# EAGLE design ESP-D1-mini-mainboard (EAGLE 9.6.2)
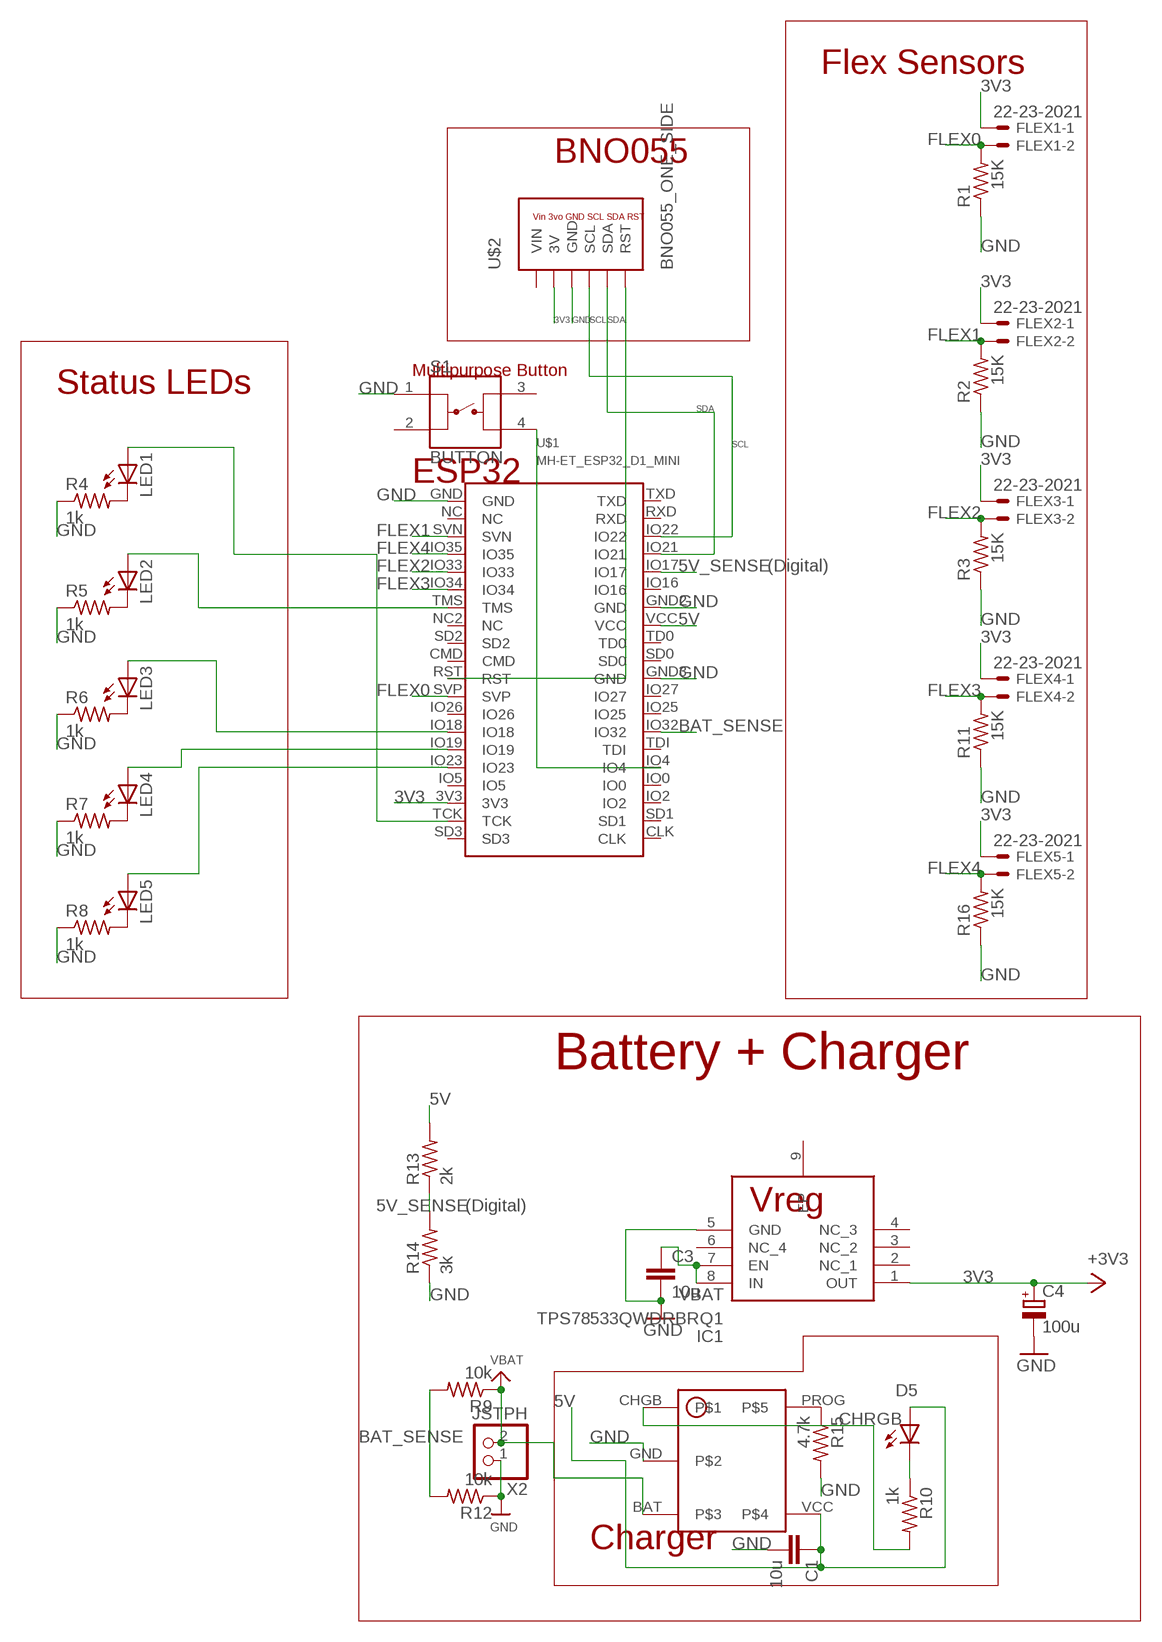
[diagram p0: schematic, sheet 1]

## Parts
C1  10u  C-EUC0805  [C0805]
C3  10u  C-EUC0805  [C0805]
C4  100u  CPOL-EUB/3528-21W  [B/3528-21W]
D5  GREEN  LEDCHIPLED_0805  [CHIPLED_0805]
FLEX1  22-23-2021  [22-23-2021]
FLEX2  22-23-2021  [22-23-2021]
FLEX3  22-23-2021  [22-23-2021]
FLEX4  22-23-2021  [22-23-2021]
FLEX5  22-23-2021  [22-23-2021]
IC1  TPS78533QWDRBRQ1  [SON65P300X300X100-9N]
LED1  LEDCHIPLED_0805  [CHIPLED_0805]
LED2  LEDCHIPLED_0805  [CHIPLED_0805]
LED3  LEDCHIPLED_0805  [CHIPLED_0805]
LED4  LEDCHIPLED_0805  [CHIPLED_0805]
LED5  LEDCHIPLED_0805  [CHIPLED_0805]
R1  15K  R-US_M0805  [M0805]
R2  15K  R-US_M0805  [M0805]
R3  15K  R-US_M0805  [M0805]
R4  1k  R-US_M0805  [M0805]
R5  1k  R-US_M0805  [M0805]
R6  1k  R-US_M0805  [M0805]
R7  1k  R-US_M0805  [M0805]
R8  1k  R-US_M0805  [M0805]
R9  10k  R-US_M0805  [M0805]
R10  1k  R-US_M0805  [M0805]
R11  15K  R-US_M0805  [M0805]
R12  10k  R-US_M0805  [M0805]
R13  2k  R-US_M0805  [M0805]
R14  3k  R-US_M0805  [M0805]
R15  4.7k  R-US_M0805  [M0805]
R16  15K  R-US_M0805  [M0805]
S1  BUTTON  [BUTTON_4_PAD]
U1  DIO5518BAUK+  [SOT23-5L]
U$1  MH-ET_ESP32_D1_MINI  [MH-ET_ESP32_D1_MINI]
U$2  BNO055_ONE_SIDE  [BNO055_ONE_SIDE]
X2  JSTPH  CON_JST_PH_2PIN  [JSTPH2]

## Nets
3V3: C4.+ FLEX1.1 FLEX2.1 FLEX3.1 FLEX4.1 FLEX5.1 IC1.1(OUT) U$1.3V3 U$2.3V ; supply symbol labelled +3V3
5V: C1.1 D5.A R13.2 U1.VCC U$1.VCC
5V_SENSE: R13.1 R14.2 U$1.IO17
BAT_SENSE: R9.2 R12.2 U$1.IO32
CHRGB: R10.2 U1.CHGB
FLEX0: FLEX1.2 R1.2 U$1.SVP
FLEX1: FLEX2.2 R2.2 U$1.SVN
FLEX2: FLEX3.2 R3.2 U$1.IO33
FLEX3: FLEX4.2 R11.2 U$1.IO34
FLEX4: FLEX5.2 R16.2 U$1.IO35
GND: C1.2 C3.2 C4.- IC1.5(GND) R1.1 R2.1 R3.1 R4.1 R5.1 R6.1 R7.1 R8.1 R11.1 R12.1 R14.1 R15.2 R16.1 S1.1 U1.GND U$1.GND U$1.GND2(GND) U$1.GND3(GND) U$2.GND X2.1
N$1: LED1.C R4.2
N$2: LED2.C R5.2
N$3: LED3.C R6.2
N$4: LED4.C R7.2
N$5: LED5.C R8.2
N$9: LED1.A U$1.TCK
N$10: LED2.A U$1.TMS
N$11: S1.4 U$1.IO4
N$12: LED3.A U$1.IO18
N$13: U$1.RST U$2.RST
N$14: D5.C R10.1
N$19: LED4.A U$1.IO19
N$20: LED5.A U$1.IO23
PROG: R15.1 U1.PROG
SCL: U$1.IO22 U$2.SCL
SDA: U$1.IO21 U$2.SDA
VBAT: C3.1 IC1.7(EN) IC1.8(IN) R9.1 U1.BAT X2.2
Unconnected: IC1.2(NC_1) IC1.3(NC_2) IC1.4(NC_3) IC1.6(NC_4) IC1.9(EP) S1.2 S1.3 U$1.CLK U$1.CMD U$1.IO0 U$1.IO2 U$1.IO5 U$1.IO16 U$1.IO25 U$1.IO26 U$1.IO27 U$1.NC U$1.NC2(NC) U$1.RXD U$1.SD0 U$1.SD1 U$1.SD2 U$1.SD3 U$1.TD0 U$1.TDI U$1.TXD U$2.VIN

## Notes on the sheet
- Flex Sensors
- BNO055
- Vin 3vo GND SCL SDA RST
- Multipurpose Button
- Status LEDs
- ESP32
- (Digital)
- Battery + Charger
- (Digital) | Vreg
- Charger

## Library data of the parts
C1 C3 = rcl:C-EU: CAPACITOR, European symbol; SPICEPREFIX: C
C4 = rcl:CPOL-EU: POLARIZED CAPACITOR, European symbol; SPICEPREFIX: C
D5 LED1-LED5 = adafruit:LED: LED OSRAM: - CHIPLED LG R971, LG N971, LY N971, LG Q971, LY Q971, LO R971, LY R971 LH N974, LH R974 LS Q976, LO Q976, LY Q976 LO Q996 - Hyper CHIPLED LW Q18S LB Q993, LB Q99A, LB R99A - SideLED LS A670, LO A670, LY A670, LG A670, LP A670 LB A673, LV A673, LT A673, LW A673 LH A674 LY A675 LS A676, LA A676, LO A676, LY A676, LW A676 LS A679, LY A679, LG A679 - Hyper Micro SIDELED® LS Y876, LA Y876, LO Y876, LY Y876 LT Y87S - SmartLED LW L88C, LW L88S LB L89C, LB L89S, LG L890 LS L89K, LO L89K, LY L89K LS L896, LA L896, LO L896, LY L896 - TOPLED LS T670, LO T670, LY T670, LG T670, LP T670 LSG T670, LSP T670, LSY T670, LOP T670, LYG T670 LG T671, LOG T671, LSG T671 LB T673, LV T673, LT T673, LW T673 LH T674 LS T676, LA T676, LO T676, LY T676, LB T676, LH T676, LSB T676, LW T676 LB T67C, LV T67C, LT T67C, LS T67K, LO T67K, LY T67K, LW E67C LS E67B, LA E67B, LO E67B, LY E67B, LB E67C, LV E67C, LT E67C LW T67C LS T679, LY T679, LG T679 LS T770, LO T770, LY T770, LG T770, LP T770 LB T773, LV T773, LT T773, LW T773 LH T774 LS E675, LA E675, LY E675, LS T675 LS T776, LA T776, LO T776, LY T776, LB T776 LHGB T686 LT T68C, LB T68C - Hyper Mini TOPLED® LB M676 - Mini TOPLED Santana® LG M470 LS M47K, LO M47K, LY M47K Source: http://www.osram.convergy.de/
FLEX1-FLEX5 = con-molex:22-23-2021: .100" (2.54mm) Center Header - 2 Pin; MF: MOLEX; MPN: 22-23-2021; OC_FARNELL: 1462926; OC_NEWARK: 25C3832
IC1 = TPS78533QWDRBRQ1:TPS78533QWDRBRQ1: LDO Voltage Regulators Automotive, 1-A, high-accuracy, adjustable low-dropout (LDO) linear regulator Source: Datasheet <https://www.arrow.com/en/products/tps78533qwdrbrq1/texas-instruments?region=nac>; DESCRIPTION: LDO Voltage Regulators Automotive, 1-A, high-accuracy, adjustable low-dropout (LDO) linear regulator; HEIGHT: 1mm; MANUFACTURER_NAME: Texas Instruments; MANUFACTURER_PART_NUMBER: TPS78533QWDRBRQ1; MOUSER_PART_NUMBER: 595-TPS78533QWDRBRQ1; MOUSER_PRICE-STOCK: https://www.mouser.co.uk/ProductDetail/Texas-Instruments/TPS78533QWDRBRQ1?qs=iLbezkQI%252BsiNbdqh2Ko9GQ%3D%3D
R1-R16 = adafruit:R-US_: RESISTOR, American symbol
S1 = NFR:BUTTON: Button SPST-NO DigiKey <https://www.digikey.com/en/products/detail/c-k/PTS525SM15SMTR2-LFS/1146855>; DESCRIPTION: Tactile Switch SPST-NO Top Actuated Surface Mount; DIGI-KEY_PART_NUMBER: CKN9104TR-ND; MF: C&K; MP: PTS525SM15SMTR2 LFS; PACKAGE: Tactile Switch CK; PURCHASE-URL: https://pricing.snapeda.com/search/part/PTS525SM15SMTR2 LFS/?ref=eda
U1 = DIO5518B:DIO5518B: MAX4230 Single-Supply, Rail-to-Rail I/O, High-Output-Drive OpAmp Maxim Integrated Products (Source: www.maxim-ic.com) MAX4230AUK+.. 5-Lead SOT23, RoHS-Compliant Author: Dipl.-Ing. FH Rainer Bayer HHN Hochschule Heilbronn, rainer.bayer@hs-heilbronn.de Ingenieurbüro ing-rb, mail@ing-rb.de
U$1 = MH-ET_ESP32_D1_MINI:MH-ET_ESP32_D1_MINI
U$2 = BNO055:BNO055_ONE_SIDE
X2 = microbuilder:CON_JST_PH_2PIN: JST 2-Pin Right-Angle Connector PH-Series - 4UConnector: 17311 SH-Series - 4UConnector: 07278

## Net classes
1 GND: width 0.4 mm
2 VCC: width 0.4 mm

## Board
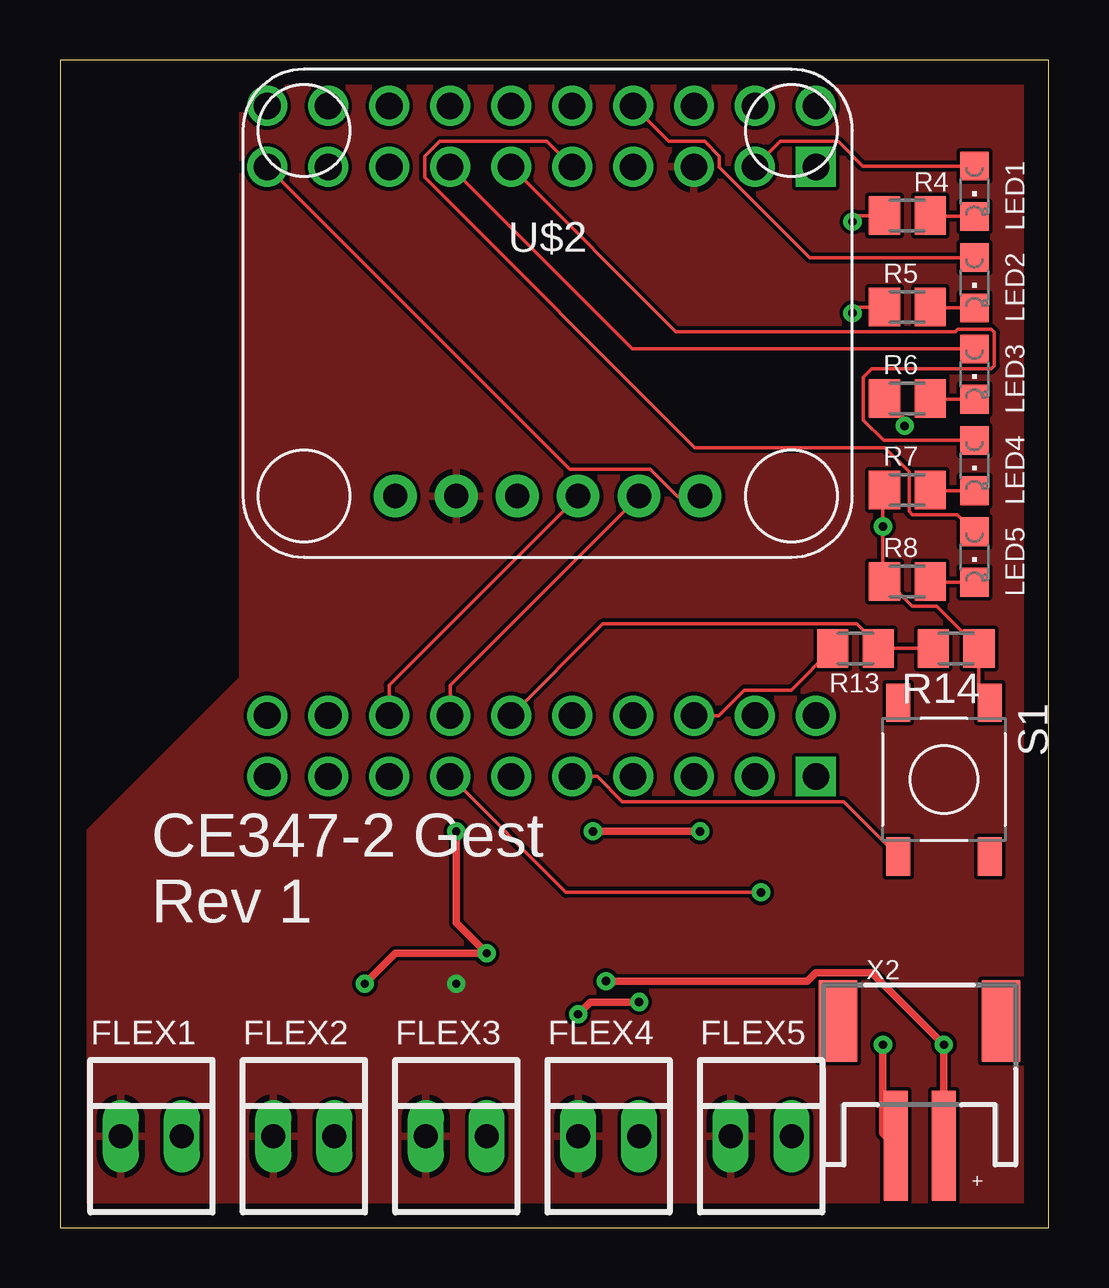
[diagram p1: board, top side]
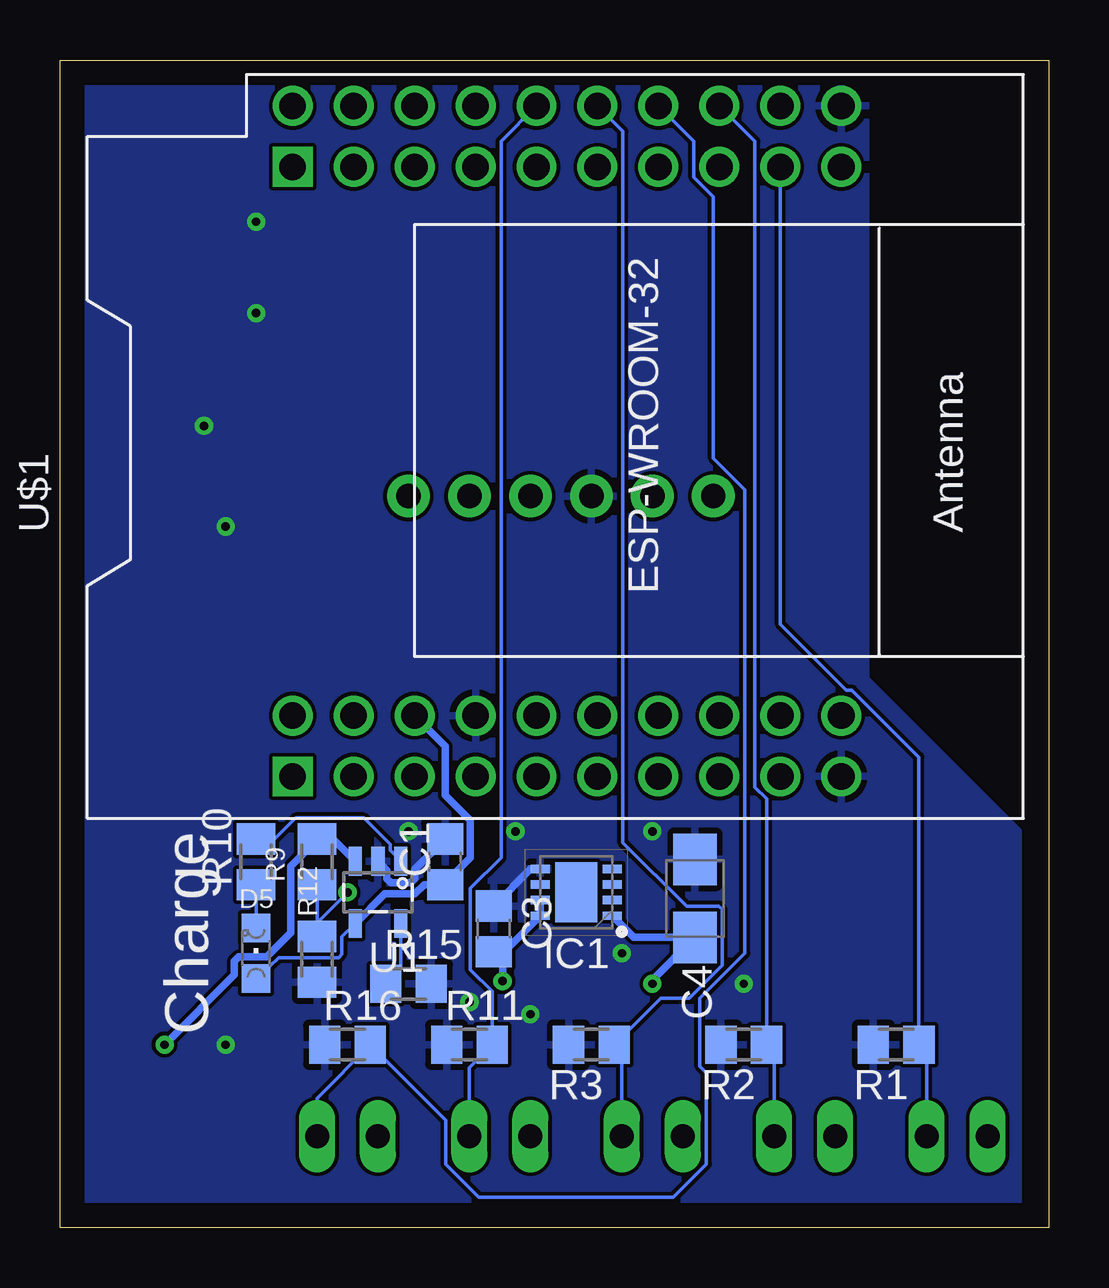
[diagram p2: board, bottom side, seen from below]

Size 41.19 x 48.65 mm. Coordinates in mm from the lower left corner, seen from the top.
Outline: 0,0 41.19,0 41.19,48.65 0,48.65 0,0
Copper layers (1*16): Top 0.035mm / dielectric 1.5mm / Bottom 0.035mm
Design rules "default": minimum track width 6mil, minimum drill 0.35mm, track to track 6mil, track to pad 6mil, pad to pad 6mil, via to via 6mil, smd to smd 6mil, copper to edge 40mil, drill to drill 6mil, minimum pad ring 10mil, minimum via ring 8mil, stop-mask expansion 4mil, vias tented up to drill 0mil, thermal gap 10mil

### Footprints (pad centres in the part's own frame; a part is rotated, then mirrored left to right if it is on the bottom)
C0805 = smd 1.3 x 1.5: 1 -0.95,0; 2 0.95,0
B/3528-21W = smd 2.15 x 1.8: + 1.625,0; - -1.625,0
CHIPLED_0805 = smd 1.2 x 1.2: A 0,-1.05; C 0,1.05
22-23-2021 = drill 1 long: 1 -1.27,0; 2 1.27,0
SON65P300X300X100-9N = smd 0.8 x 0.35: 1 -1.5,0.975; 2 -1.5,0.325; 3 -1.5,-0.325; 4 -1.5,-0.975; 5 1.5,-0.975; 6 1.5,-0.325; 7 1.5,0.325; 8 1.5,0.975 | smd 1.75 x 2.5: 9 0,0
M0805 = smd 1.3 x 1.6: 1 -0.95,0; 2 0.95,0
BUTTON_4_PAD = smd 1.6 x 1: 1 -3.2,1.9; 2 3.2,1.9; 3 -3.2,-1.9; 4 3.2,-1.9
SOT23-5L = smd 0.55 x 1.2: BAT 0.95,-1.3; CHGB -0.95,-1.3; GND 0,-1.3; PROG -0.95,1.3; VCC 0.95,1.3
MH-ET_ESP32_D1_MINI = drill 1.11 pad 1.665: 3V3 25.4,-5.08; CMD 27.94,0; GND 0,-22.86; GND2 2.54,-7.62; GND3 27.94,-22.86; IO0 0,-7.62; IO2 0,-5.08; IO4 0,-10.16; IO5 25.4,-7.62; IO16 2.54,-10.16; IO17 2.54,-12.7; IO18 25.4,-15.24; IO19 25.4,-12.7; IO21 2.54,-15.24; IO22 2.54,-17.78; IO23 25.4,-10.16; IO25 0,-17.78; IO26 25.4,-17.78; IO27 0,-20.32; IO32 0,-15.24; IO33 27.94,-12.7; IO34 27.94,-10.16; IO35 27.94,-15.24; NC 27.94,-20.32; NC2 27.94,-5.08; RST 25.4,-22.86; RXD 2.54,-20.32; SD0 2.54,0; SD1 0,-2.54; SD2 27.94,-2.54; SVN 27.94,-17.78; SVP 25.4,-20.32; TCK 25.4,-2.54; TD0 2.54,-2.54; TDI 0,-12.7; TMS 27.94,-7.62; TXD 2.54,-22.86; VCC 2.54,-5.08 | drill 1.11 pad 1.665 square: CLK 0,0; SD3 25.4,0
BNO055_ONE_SIDE = drill 1.016 pad 1.778: 3V -3.81,-7.62; GND -1.27,-7.62; RST 6.35,-7.62; SCL 1.27,-7.62; SDA 3.81,-7.62; VIN -6.35,-7.62
JSTPH2 = smd 1 x 4.6: 1 -1,-3.7; 2 1,-3.7 | smd 1.6 x 3.4: NC1 -3.4,1.5; NC2 3.4,1.5

### Placement (x,y rotation side)
C1  25.15,15.24 90 bottom
C3  23.11,12.45 90 bottom
C4  14.73,13.72 270 bottom
D5  33.02,11.43 0 bottom
FLEX1  3.81,3.81 0 top
FLEX2  10.16,3.81 0 top
FLEX3  16.51,3.81 0 top
FLEX4  22.86,3.81 0 top
FLEX5  29.21,3.81 0 top
IC1  19.68,13.97 180 bottom
LED1  38.1,43.18 180 top
LED2  38.1,39.37 180 top
LED3  38.1,35.56 180 top
LED4  38.1,31.75 180 top
LED5  38.1,27.94 180 top
R1  6.35,7.62 0 bottom
R2  12.7,7.62 0 bottom
R3  19.05,7.62 0 bottom
R4  35.31,42.16 0 top
R5  35.31,38.35 0 top
R6  35.31,34.54 0 top
R7  35.31,30.73 0 top
R8  35.31,26.92 0 top
R9  30.48,15.24 270 bottom
R10  33.02,15.24 90 bottom
R11  24.13,7.62 0 bottom
R12  30.48,11.18 90 bottom
R13  33.15,24.13 180 top
R14  37.34,24.13 180 top
R15  26.67,10.16 0 bottom
R16  29.21,7.62 0 bottom
S1  36.83,18.67 270 top
U1  27.94,13.97 180 bottom
U$1  31.5,18.8 90 bottom
U$2  20.32,38.1 0 top
X2  35.81,7.11 0 top

### Tracks (layer width: path | path; a pad name or v marks a point on that pad's centre or on a via)
3V3  (via drill 0.35)
  Bottom 0.305: IC1.1 17.28,12.09 C4.+ 16.51,10.31 v16.51,10.16
  pour Top: 1.27,0 1.27,16.51 7.62,22.86 7.62,48.26 40.64,48.26 40.64,0
5V
  Top 0.152: R13.2 30.46,22.4 28.52,22.4 27.45,21.34 U$1.VCC
  Bottom 0.152: D5.A 32.5,10.9 32.43,10.9 32.08,11.25 29.59,11.25 29.45,11.38 29.45,12.11 U1.VCC
  Bottom 0.305: U1.VCC 27.65,13.91 26.4,13.91 26.02,14.29 C1.1 25.15,14.36 24.09,15.41 24.09,16.97 25.15,18.02 25.15,20.07 U$1.VCC
5V_SENSE
  Top 0.152: R14.2 R13.1 34.1,24.26 33.2,25.16 22.62,25.16 U$1.IO17
BAT_SENSE  (via drill 0.35)
  Top 0.152: v29.21,13.97 21.08,13.97 U$1.IO32
  Bottom 0.152: R12.2 30.48,12.7 | 30.48,12.7 R9.2 | 30.48,12.7 v29.21,13.97
CHRGB
  Bottom 0.152: U1.CHGB 27.44,15.72 27.44,15.96 28.54,17.07 31.38,17.07 32.25,16.19 R10.2
FLEX0
  Bottom 0.152: FLEX1.2 5.08,7.3 R1.2 5.4,19.6 8.2,22.4 8.43,22.4 11.18,25.15 U$1.SVP
FLEX1
  Bottom 0.152: FLEX2.2 11.43,7.3 R2.2 11.75,17.87 12.24,18.36 12.24,45.26 U$1.SVN
FLEX2
  Bottom 0.152: FLEX3.2 17.78,7.3 R3.2 16.17,9.55 14.97,9.55 13.6,10.92 13.6,13.26 13.74,13.39 15.08,13.39 17.73,16.05 17.73,45.67 U$1.IO33
FLEX3
  Bottom 0.152: FLEX4.2 24.13,6.67 R11.2 23.18,9.84 24.09,10.75 24.09,14.14 22.82,15.42 22.82,45.26 U$1.IO34
FLEX4
  Bottom 0.152: FLEX5.2 30.48,5.4 R16.2 25.11,4.47 25.11,2.65 23.73,1.27 15.64,1.27 14.26,2.65 14.26,6.45 14.53,6.72 14.53,9.56 12.65,11.44 12.65,30.75 13.97,32.06 13.97,42.95 14.78,43.76 14.78,45.26 U$1.IO35
GND  (via drill 0.35)
  Top 0.152: R4.1 33.27,42.16 v33.02,41.91 | R5.1 33.27,38.35 v33.02,38.1 | R6.1 35.19,33.71 v35.19,33.41 | R7.1 34.29,30.67 v34.29,29.21 34.29,26.99 R8.1 34.48,26.92 35.51,25.89 36.52,25.89 R14.1 38.29,22.31 S1.1
  Top 0.305: X2.1 34.29,3.94 v34.29,7.62 | v21.59,8.89 22.1,9.4 v24.13,9.4 | v22.21,16.51 v26.67,16.51 | v16.51,16.51 16.51,12.7 v17.78,11.43 13.97,11.43 v12.7,10.16
  Bottom 0.305: 27.94,15.63 U1.GND 27.57,14.9 27.57,14.54 27.39,14.37 26.59,14.37 26.41,14.54 26.41,14.93 C1.2 | C3.2 21.57,14.95 IC1.5
  pour Bottom: 1.27,0 1.27,16.51 7.62,22.86 7.62,48.26 40.64,48.26 40.64,0
N$1
  Top 0.152: LED1.C 36.29,42.13 R4.2
N$2
  Top 0.152: LED2.C 36.29,38.32 R5.2
N$3
  Top 0.152: LED3.C 36.29,34.51 R6.2
N$4
  Top 0.152: LED4.C 36.29,30.7 R7.2
N$5
  Top 0.152: LED5.C 36.29,26.89 R8.2
N$9
  Top 0.152: LED1.A 33.45,44.23 32.42,45.26 30.02,45.26 U$1.TCK
N$10
  Top 0.152: U$1.TMS 25.36,45.26 26.86,45.26 27.48,44.64 27.48,44.17 31.23,40.42 LED2.A
N$11
  Top 0.152: S1.4 32.66,17.73 23.44,17.73 22.38,18.8 U$1.IO4
N$12
  Top 0.152: LED3.A 23.84,36.61 U$1.IO18
N$13
  Top 0.152: U$1.RST 21.23,31.6 24.59,31.6 25.71,30.48 U$2.RST
N$14
  Bottom 0.152: D5.C R10.1
N$19
  Top 0.152: LED4.A 34.33,32.8 33.48,33.65 33.48,35.44 33.82,35.78 38.8,35.78 38.93,35.91 38.93,37.3 38.8,37.44 37.41,37.44 37.29,37.33 25.67,37.33 U$1.IO19
N$20
  Top 0.152: LED5.A 37.38,29.7 35.51,29.7 35.38,29.84 35.38,31.49 34.37,32.49 26.46,32.49 15.2,43.76 15.2,44.64 15.82,45.26 20.27,45.26 U$1.IO23
PROG
  Bottom 0.152: U1.PROG 26.99,10.79 R15.1
SCL
  Top 0.152: U$2.SCL 13.72,22.61 U$1.IO22
SDA
  Top 0.152: U$2.SDA 16.26,22.61 U$1.IO21
VBAT  (via drill 0.35)
  Top 0.305: X2.2 36.83,3.43 v36.83,7.62 33.83,10.62 31.49,10.62 31.14,10.27 v22.75,10.27
  Bottom 0.305: IC1.7 IC1.8 22.68,11.5 C3.1 22.75,11.13 v22.75,10.27 | U1.BAT 29.81,16.19 R9.1 30.48,16.17 31.59,15.07 31.59,12.28 32.58,11.29 33.75,11.29 33.92,11.11 33.92,10.53 v36.83,7.62

### Text on the board
tPlace: CE347-2 Gest / Rev 1 | +
bPlace: Charge